# EasyEDA Pro project ProProject_星仪245接地转接模块_2023-08-28.epro

# Schematic Schematic1
Create Date: 2022-03-23; Project Name: typec-typec; Schematic Name: Schematic1; Update Date: 2022-03-23
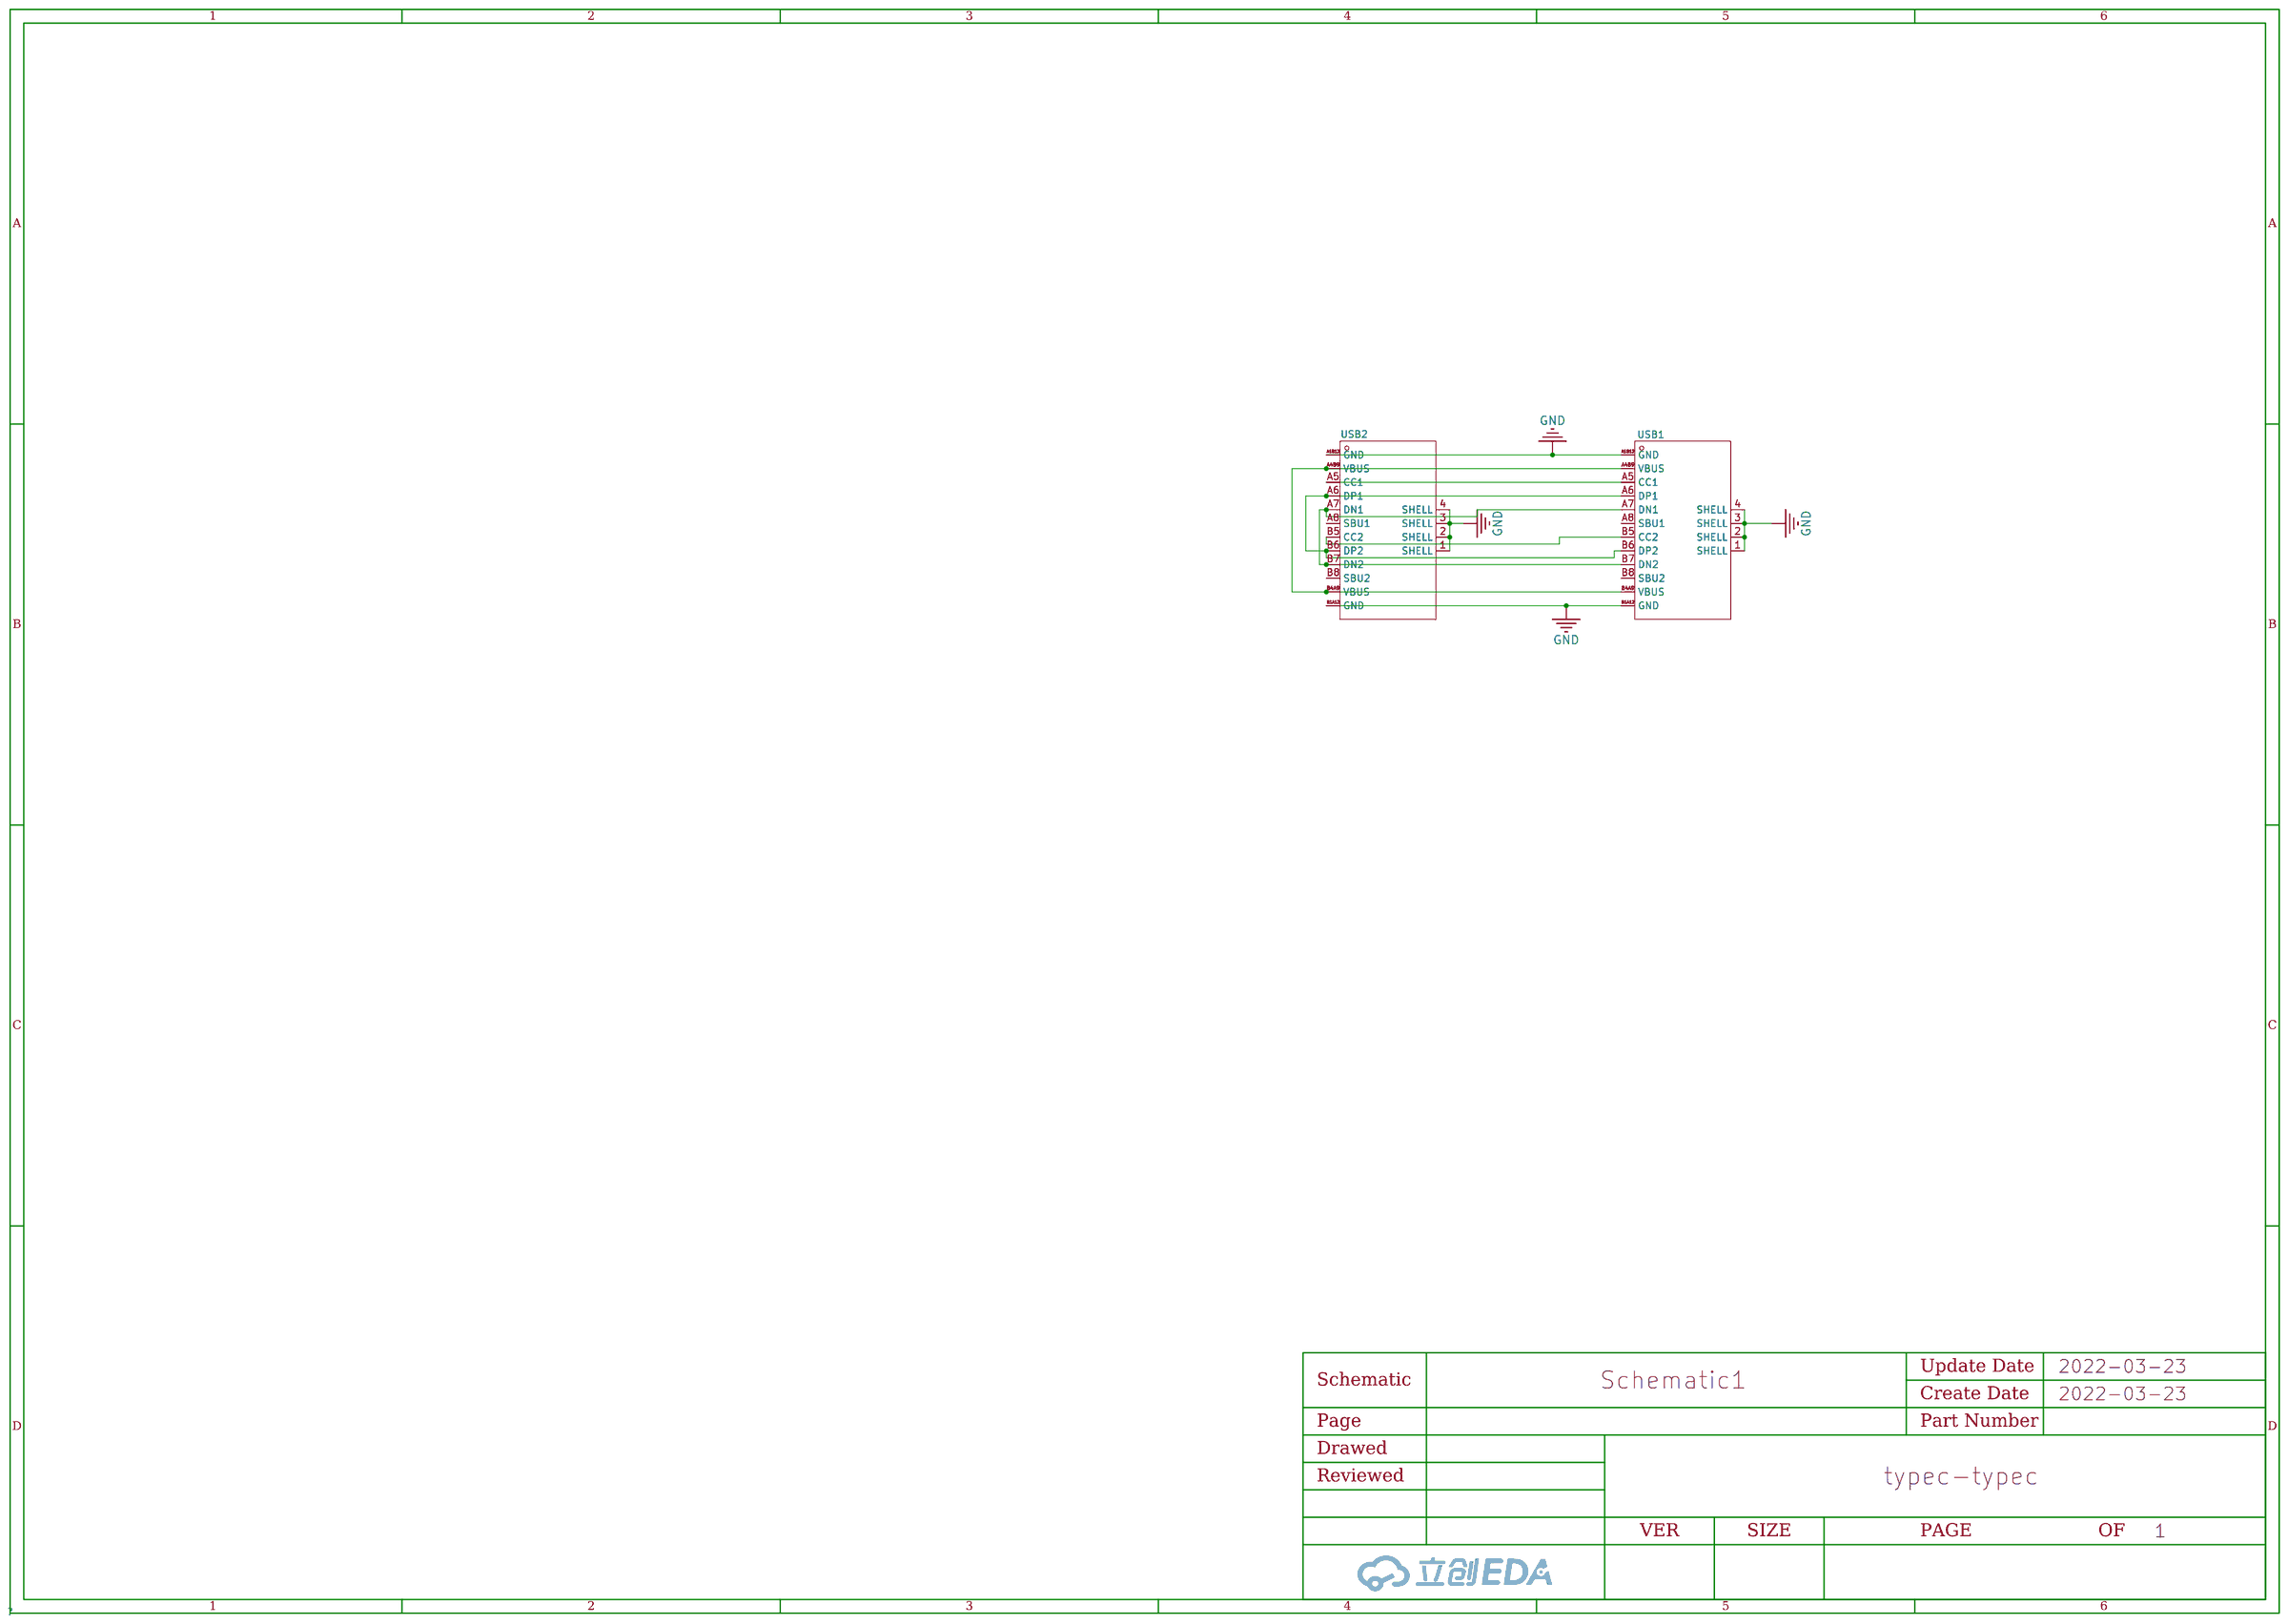
[diagram p0: schematic sheet]

## Parts
USB1  -  [USB-C-SMD_TYPE-C16PIN]
USB2  -  [USB-C-SMD_TYPE-C16PIN]

## Library data of the parts
USB1 USB2 = TYPEC12PINCONN: Supplier Part: C9900004950; Supplier Footprint: TYPE-C16PIN母座; Supplier: LCSC; JLCPCB Part Class: Extended Part

## Nets
GND: USB1.1(SHELL) USB1.2(SHELL) USB1.3(SHELL) USB1.4(SHELL) USB1.A1B12(GND) USB1.B1A12(GND) USB2.1(SHELL) USB2.2(SHELL) USB2.3(SHELL) USB2.4(SHELL) USB2.A1B12(GND) USB2.B1A12(GND)
$1N519: USB1.A4B9(VBUS) USB1.B4A9(VBUS) USB2.A4B9(VBUS) USB2.B4A9(VBUS)
$1N522: USB1.A5(CC1) USB2.A5(CC1)
$1N525: USB1.A6(DP1) USB1.B6(DP2) USB2.A6(DP1) USB2.B6(DP2)
$1N546: USB1.A7(DN1) USB1.B7(DN2) USB2.A7(DN1) USB2.B7(DN2)
$1N563: USB1.B5(CC2) USB2.B5(CC2)

Not connected (* = marked no-connect by the designer): USB1 A8(SBU1) B8(SBU2); USB2 A8(SBU1) B8(SBU2)

# Board PCB1
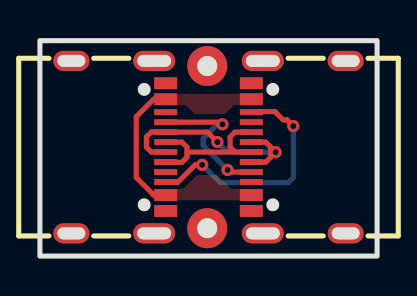
[diagram p1: board, top side]
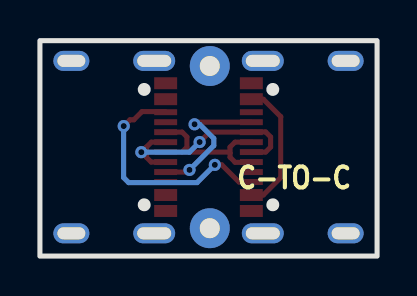
[diagram p2: board, bottom side, seen from below]

Outline 16.89 x 10.8 mm; copper layers: Top Layer, Bottom Layer. Coordinates in mm from the lower left corner of the outline.
Outline path: rectangle 0,10.8 16.89,0
Stack: Top Layer 0.035mm / 介电1 1.51mm FR4 er 4.5 / Bottom Layer 0.035mm

## Design rules (mm)
spacing safeClearance (default): track to track 0.152, other pairs 0.152 to 0.3
track width trackWidth (default): min 0.127, default 0.254, max 2.54
differential pair differentialPair (default): width min 0.127, default 0.254, max 2.54; gap min 0.152, default 0.152
via viaSize (default): diameter min 0.5, default 0.61, max 10; hole min 0.3, default 0.305, max 6
net GND uses copperRegion1
net $1N519 uses copperRegion1

## Placement (name value [footprint] x y rotation side)
NOREF  -  [Pad_e60]  8.38 9.53 0 top
NOREF#2  -  [Pad_e58]  8.38 1.4 0 top
USB1  -  [USB-C-SMD_TYPE-C16PIN]  12.95 5.46 90 top
USB2  -  [USB-C-SMD_TYPE-C16PIN]  3.94 5.46 270 top

## Footprints (pads in the part's own frame, mm; a bottom-side part is the same pattern mirrored in y, then rotated)
Pad_e58
  round 2 hole 1: 1(0,0)
Pad_e60
  round 2 hole 1: 1(0,0)
USB-C-SMD_TYPE-C16PIN
  oval 1.001x2.1 hole 0.6x1.7: 1(-4.321,1.788) 2(4.321,1.788)
  oval 1.001x1.801 hole 0.6x1.399: 3(-4.321,-2.362) 4(4.321,-2.362)
  rect 0.6x1.151 smd: A1B12(-3.2,2.362) A4B9(-2.401,2.362) B1A12(3.2,2.362) B4A9(2.401,2.362)
  rect 0.299x1.151 smd: A5(-1.25,2.362) A6(-0.249,2.362) A7(0.249,2.362) A8(-1.75,2.362) B5(1.75,2.362) B6(0.75,2.362) B7(-0.75,2.362) B8(1.25,2.362)

## Nets
As in the schematic, except:
GND: NOREF.1 NOREF#2.1 USB1.1 USB1.2 USB1.3 USB1.4 USB1.A1B12 USB1.B1A12 USB2.1 USB2.2 USB2.3 USB2.4 USB2.A1B12 USB2.B1A12

Pads without a net: USB1 A8 B8; USB2 A8 B8

## Via types
v1: diameter 0.61, hole 0.305, Top Layer to Bottom Layer, 6 vias

## Routing (per net, layer and track width the routed paths; a pad name or vN(x,y) marks a point on that pad's centre or on a via; arc(x,y) is an arc through that point)
$1N519: length 6.7
  Top Layer w0.254: USB2.B4A9 5.7,3.06 4.83,3.94 4.83,6.98 5.7,7.86 USB2.A4B9
$1N522: length 7.5
  Top Layer w0.254: v1(9.4,4.32) 9.48,4.32 9.58,4.21 USB1.A5 ; v1(9.14,6.6) 9.04,6.71 USB2.A5
  Bottom Layer w0.254: v1(9.4,4.32) 8.18,5.54 8.18,5.89 8.89,6.6 v1(9.14,6.6)
$1N525: length 8.1
  Top Layer w0.254: 9.77,5.21 USB1.A6 ; 9.77,5.21 7.41,5.21 7.37,5.16 ; 9.77,5.21 9.53,5.46 9.53,5.97 9.77,6.21 USB1.B6 ; USB2.A6 7.12,5.71 7.37,5.46 7.37,5.16 ; 7.37,5.16 7.37,4.95 7.11,4.7 6.31,4.7 USB2.B6
$1N546: length 11.6
  Top Layer w0.254: USB2.A7 5.58,5.21 5.33,5.46 5.33,5.97 5.59,6.22 6.29,6.22 USB2.B7 8.39,6.21 v1(8.89,5.72) ; 11.56,5.46 11.31,5.71 USB1.A7 ; 11.56,5.46 11.56,4.95 11.32,4.71 USB1.B7 ; 11.56,5.46 v1(11.81,5.21)
  Bottom Layer w0.254: v1(8.89,5.72) 9.4,5.21 v1(11.81,5.21)
$1N563: length 12.2
  Top Layer w0.254: USB1.B5 10.62,7.24 11.78,7.24 12.19,6.83 12.38,6.83 v1(12.69,6.51) ; USB2.B5 6.92,3.71 7.78,4.57 v1(8.13,4.57)
  Bottom Layer w0.254: v1(8.13,4.57) 9.02,3.68 12.45,3.68 12.7,3.94 12.7,6.44 12.71,6.45

## Copper pours and planes (outline as drawn; the poured copper is in the pictures)
GND on Top Layer: 0,10.84 16.89,10.84 16.89,-0.11 0,-0.11
GND on Bottom Layer: 0.03,10.83 16.98,10.83 16.98,-0.07 0.03,-0.07
$1N519 on Top Layer: 5.74,4.06 11.17,4.06 11.17,2.79 5.74,2.79
$1N519 on Top Layer: 5.72,8.13 11.15,8.13 11.15,7.11 5.72,7.11

## Text on the board
Bottom Silkscreen Layer: C-TO-C
